# Altium schematic sheet 09_CONNECTOR.SchDoc
size A3; SheetNumber: 12; SheetTotal: 14
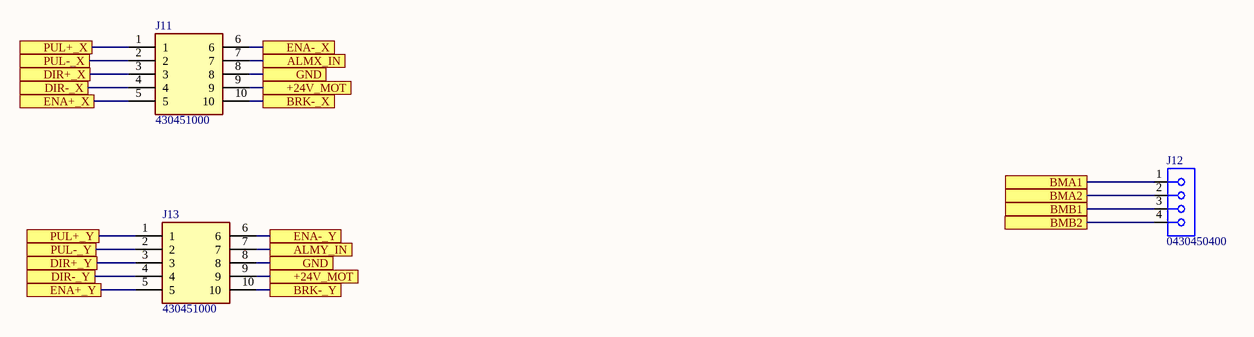
[diagram p0: 09_CONNECTOR.SchDoc]

## Parts
J11  430451000  [430451010]
J12  0430450400  [CONN_SD-43045-001_04_MOL]
J13  430451000  [430451010]

## Ports
+24V_MOT (see 06_DRIVER[5B], 06_DRIVER[5D], 09_CONNECTOR[2A], DRIVER_2[2C], DRIVER_2[5B], DRIVER_2[5C], DRIVER_2[7A], DRIVER_2[7B]), +24V_MOT (see 06_DRIVER[5B], 06_DRIVER[5D], 09_CONNECTOR[2B], DRIVER_2[2C], DRIVER_2[5B], DRIVER_2[5C], DRIVER_2[7A], DRIVER_2[7B]), ALMX_IN (see 06_DRIVER[6B]), ALMY_IN, BMA1 (see DRIVER_2[3A], DRIVER_2[7A]), BMA2 (see DRIVER_2[3A], DRIVER_2[7B]), BMB1 (see DRIVER_2[2A], DRIVER_2[2D]), BMB2 (see DRIVER_2[2A], DRIVER_2[5D]), BRK-_X, BRK-_Y (see 06_DRIVER[5C]), DIR+_X, DIR+_Y, DIR-_X, DIR-_Y, ENA+_X, ENA+_Y, ENA-_X, ENA-_Y, GND (see 09_CONNECTOR[2A]), GND (see 09_CONNECTOR[2B]), PUL+_X, PUL+_Y, PUL-_X, PUL-_Y

## Nets
+24V_MOT: J11.9 J13.9 ; port +24V_MOT
ALMX_IN: J11.7 ; port ALMX_IN
ALMY_IN: J13.7 ; port ALMY_IN
BMA1: J12.1 ; port BMA1
BMA2: J12.2 ; port BMA2
BMB1: J12.3 ; port BMB1
BMB2: J12.4 ; port BMB2
BRK-_X: J11.10 ; port BRK-_X
BRK-_Y: J13.10 ; port BRK-_Y
DIR+_X: J11.3 ; port DIR+_X
DIR+_Y: J13.3 ; port DIR+_Y
DIR-_X: J11.4 ; port DIR-_X
DIR-_Y: J13.4 ; port DIR-_Y
ENA+_X: J11.5 ; port ENA+_X
ENA+_Y: J13.5 ; port ENA+_Y
ENA-_X: J11.6 ; port ENA-_X
ENA-_Y: J13.6 ; port ENA-_Y
GND: J11.8 J13.8 ; port GND
PUL+_X: J11.1 ; port PUL+_X
PUL+_Y: J13.1 ; port PUL+_Y
PUL-_X: J11.2 ; port PUL-_X
PUL-_Y: J13.2 ; port PUL-_Y

## Library data of the parts
J11 J13 = 430451000: Connector; Manufacturer_Name: Molex; Datasheet Link: https://www.molex.com/pdm_docs/sd/430450200_sd.pdf; Height: 8.77mm; Manufacturer_Part_Number: 430451000
J12 = 0430450400: Connector Header Through Hole, Right Angle 4 position 0.118" (3.00mm); Manifacturer: MOLEX; Supplier: Digi; WM1814-ND